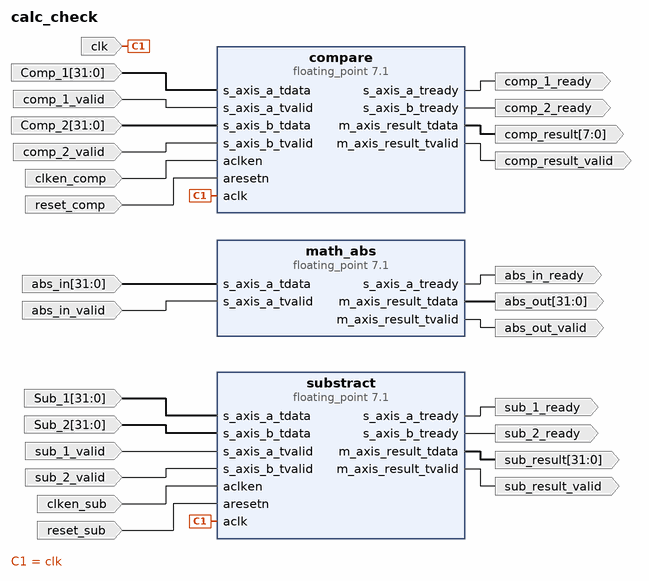
[diagram p0: block diagram of the top level]
# Vivado block design calc_check, xc7a100tcsg324-1, Vivado 2018.2
create_bd_design calc_check

create_bd_port -dir I -from 31 -to 0 -type data Comp_1
create_bd_port -dir I comp_1_valid
create_bd_port -dir O comp_1_ready
create_bd_port -dir I -from 31 -to 0 -type data Comp_2
create_bd_port -dir O comp_2_ready
create_bd_port -dir I comp_2_valid
create_bd_port -dir I -type clk clk
set_property -dict {CONFIG.FREQ_HZ 100000000} [get_bd_ports clk]
create_bd_port -dir O -from 7 -to 0 -type data comp_result
create_bd_port -dir O comp_result_valid
create_bd_port -dir I -from 31 -to 0 -type data abs_in
create_bd_port -dir O abs_in_ready
create_bd_port -dir I abs_in_valid
create_bd_port -dir O -from 31 -to 0 -type data abs_out
create_bd_port -dir O abs_out_valid
create_bd_port -dir I -from 31 -to 0 -type data Sub_1
create_bd_port -dir I -from 31 -to 0 -type data Sub_2
create_bd_port -dir I sub_1_valid
create_bd_port -dir O sub_1_ready
create_bd_port -dir O sub_2_ready
create_bd_port -dir I sub_2_valid
create_bd_port -dir O -from 31 -to 0 -type data sub_result
create_bd_port -dir O sub_result_valid
create_bd_port -dir I -type ce clken_comp
set_property -dict {CONFIG.POLARITY ACTIVE_HIGH} [get_bd_ports clken_comp]
create_bd_port -dir I -type rst reset_comp
create_bd_port -dir I -type ce clken_sub
set_property -dict {CONFIG.POLARITY ACTIVE_HIGH} [get_bd_ports clken_sub]
create_bd_port -dir I -type rst reset_sub

create_bd_cell -type ip -vlnv xilinx.com:ip:floating_point:7.1 substract
set_property -dict [list \
  CONFIG.Add_Sub_Value Subtract \
  CONFIG.Has_RESULT_TREADY false \
  CONFIG.C_Latency 12 \
  CONFIG.Has_ACLKEN true \
  CONFIG.Has_ARESETn true \
] [get_bd_cells substract]
create_bd_cell -type ip -vlnv xilinx.com:ip:floating_point:7.1 math_abs
set_property -dict [list \
  CONFIG.Operation_Type Absolute \
  CONFIG.Result_Precision_Type Single \
  CONFIG.C_Result_Exponent_Width 8 \
  CONFIG.C_Result_Fraction_Width 24 \
  CONFIG.C_Mult_Usage No_Usage \
  CONFIG.Has_RESULT_TREADY false \
  CONFIG.C_Latency 0 \
  CONFIG.C_Rate 1 \
] [get_bd_cells math_abs]
create_bd_cell -type ip -vlnv xilinx.com:ip:floating_point:7.1 compare
set_property -dict [list \
  CONFIG.Operation_Type Compare \
  CONFIG.C_Compare_Operation Less_Than \
  CONFIG.Result_Precision_Type Custom \
  CONFIG.C_Result_Exponent_Width 1 \
  CONFIG.C_Result_Fraction_Width 0 \
  CONFIG.C_Mult_Usage No_Usage \
  CONFIG.Has_RESULT_TREADY false \
  CONFIG.C_Latency 3 \
  CONFIG.C_Rate 1 \
  CONFIG.Has_ACLKEN true \
  CONFIG.Has_ARESETn true \
] [get_bd_cells compare]

# ---- connections ----

connect_bd_net -net Comp_1_1 [get_bd_ports Comp_1] [get_bd_pins compare/s_axis_a_tdata]
connect_bd_net [get_bd_ports comp_1_valid] [get_bd_pins compare/s_axis_a_tvalid]
connect_bd_net [get_bd_pins compare/s_axis_a_tready] [get_bd_ports comp_1_ready]
connect_bd_net -net Comp_2_1 [get_bd_ports Comp_2] [get_bd_pins compare/s_axis_b_tdata]
connect_bd_net [get_bd_pins compare/s_axis_b_tready] [get_bd_ports comp_2_ready]
connect_bd_net [get_bd_ports comp_2_valid] [get_bd_pins compare/s_axis_b_tvalid]
connect_bd_net [get_bd_ports clk] [get_bd_pins compare/aclk] [get_bd_pins substract/aclk]
connect_bd_net [get_bd_pins compare/m_axis_result_tdata] [get_bd_ports comp_result]
connect_bd_net [get_bd_pins compare/m_axis_result_tvalid] [get_bd_ports comp_result_valid]
connect_bd_net [get_bd_ports abs_in] [get_bd_pins math_abs/s_axis_a_tdata]
connect_bd_net [get_bd_pins math_abs/s_axis_a_tready] [get_bd_ports abs_in_ready]
connect_bd_net [get_bd_ports abs_in_valid] [get_bd_pins math_abs/s_axis_a_tvalid]
connect_bd_net [get_bd_pins math_abs/m_axis_result_tdata] [get_bd_ports abs_out]
connect_bd_net [get_bd_pins math_abs/m_axis_result_tvalid] [get_bd_ports abs_out_valid]
connect_bd_net -net Sub_1_1 [get_bd_ports Sub_1] [get_bd_pins substract/s_axis_a_tdata]
connect_bd_net -net Sub_2_1 [get_bd_ports Sub_2] [get_bd_pins substract/s_axis_b_tdata]
connect_bd_net [get_bd_ports sub_1_valid] [get_bd_pins substract/s_axis_a_tvalid]
connect_bd_net [get_bd_pins substract/s_axis_a_tready] [get_bd_ports sub_1_ready]
connect_bd_net [get_bd_pins substract/s_axis_b_tready] [get_bd_ports sub_2_ready]
connect_bd_net [get_bd_ports sub_2_valid] [get_bd_pins substract/s_axis_b_tvalid]
connect_bd_net [get_bd_pins substract/m_axis_result_tdata] [get_bd_ports sub_result]
connect_bd_net [get_bd_pins substract/m_axis_result_tvalid] [get_bd_ports sub_result_valid]
connect_bd_net -net clken_1 [get_bd_ports clken_comp] [get_bd_pins compare/aclken]
connect_bd_net -net comp_reset_1 [get_bd_ports reset_comp] [get_bd_pins compare/aresetn]
connect_bd_net [get_bd_ports clken_sub] [get_bd_pins substract/aclken]
connect_bd_net [get_bd_ports reset_sub] [get_bd_pins substract/aresetn]

validate_bd_design
save_bd_design
